# EAGLE design Actor_8_Channel (EAGLE 6.1)
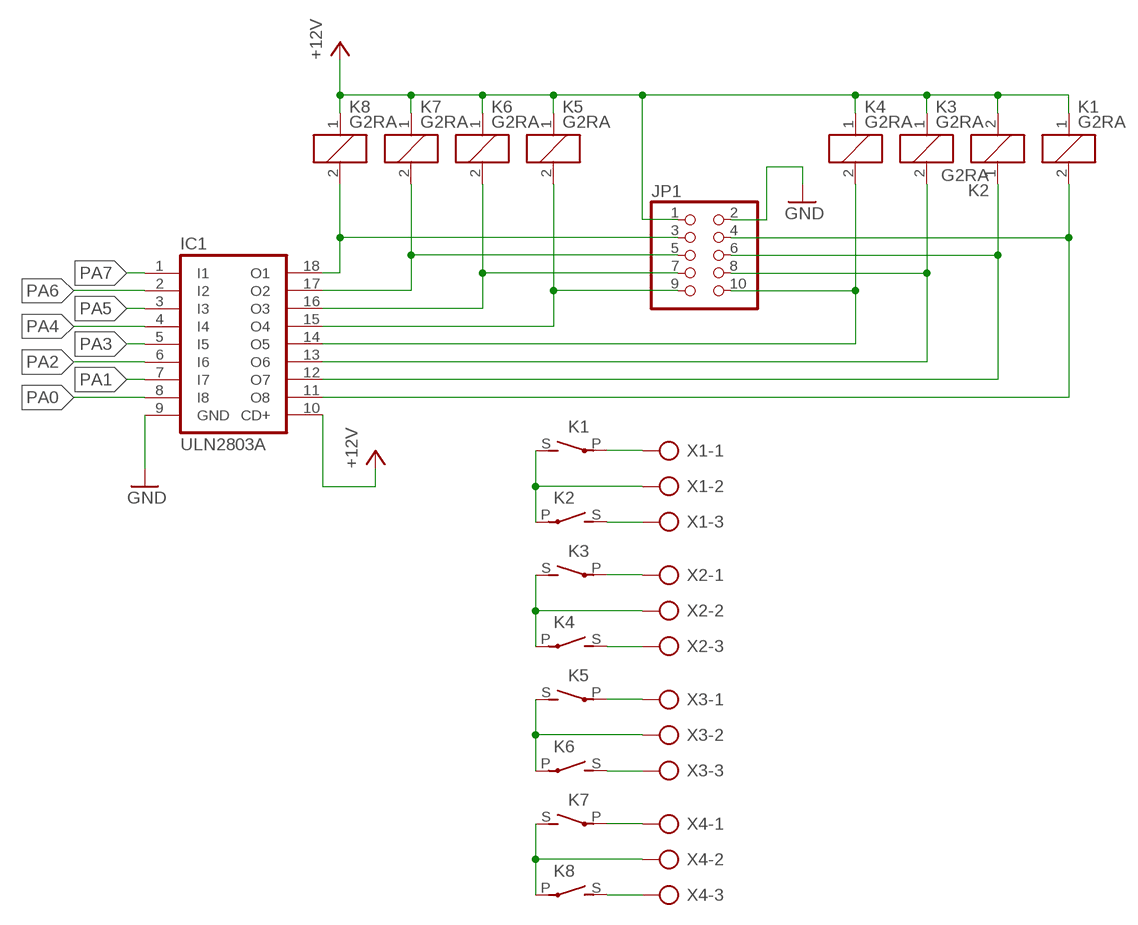
[diagram p0: schematic, sheet 1, part 1 of 2]
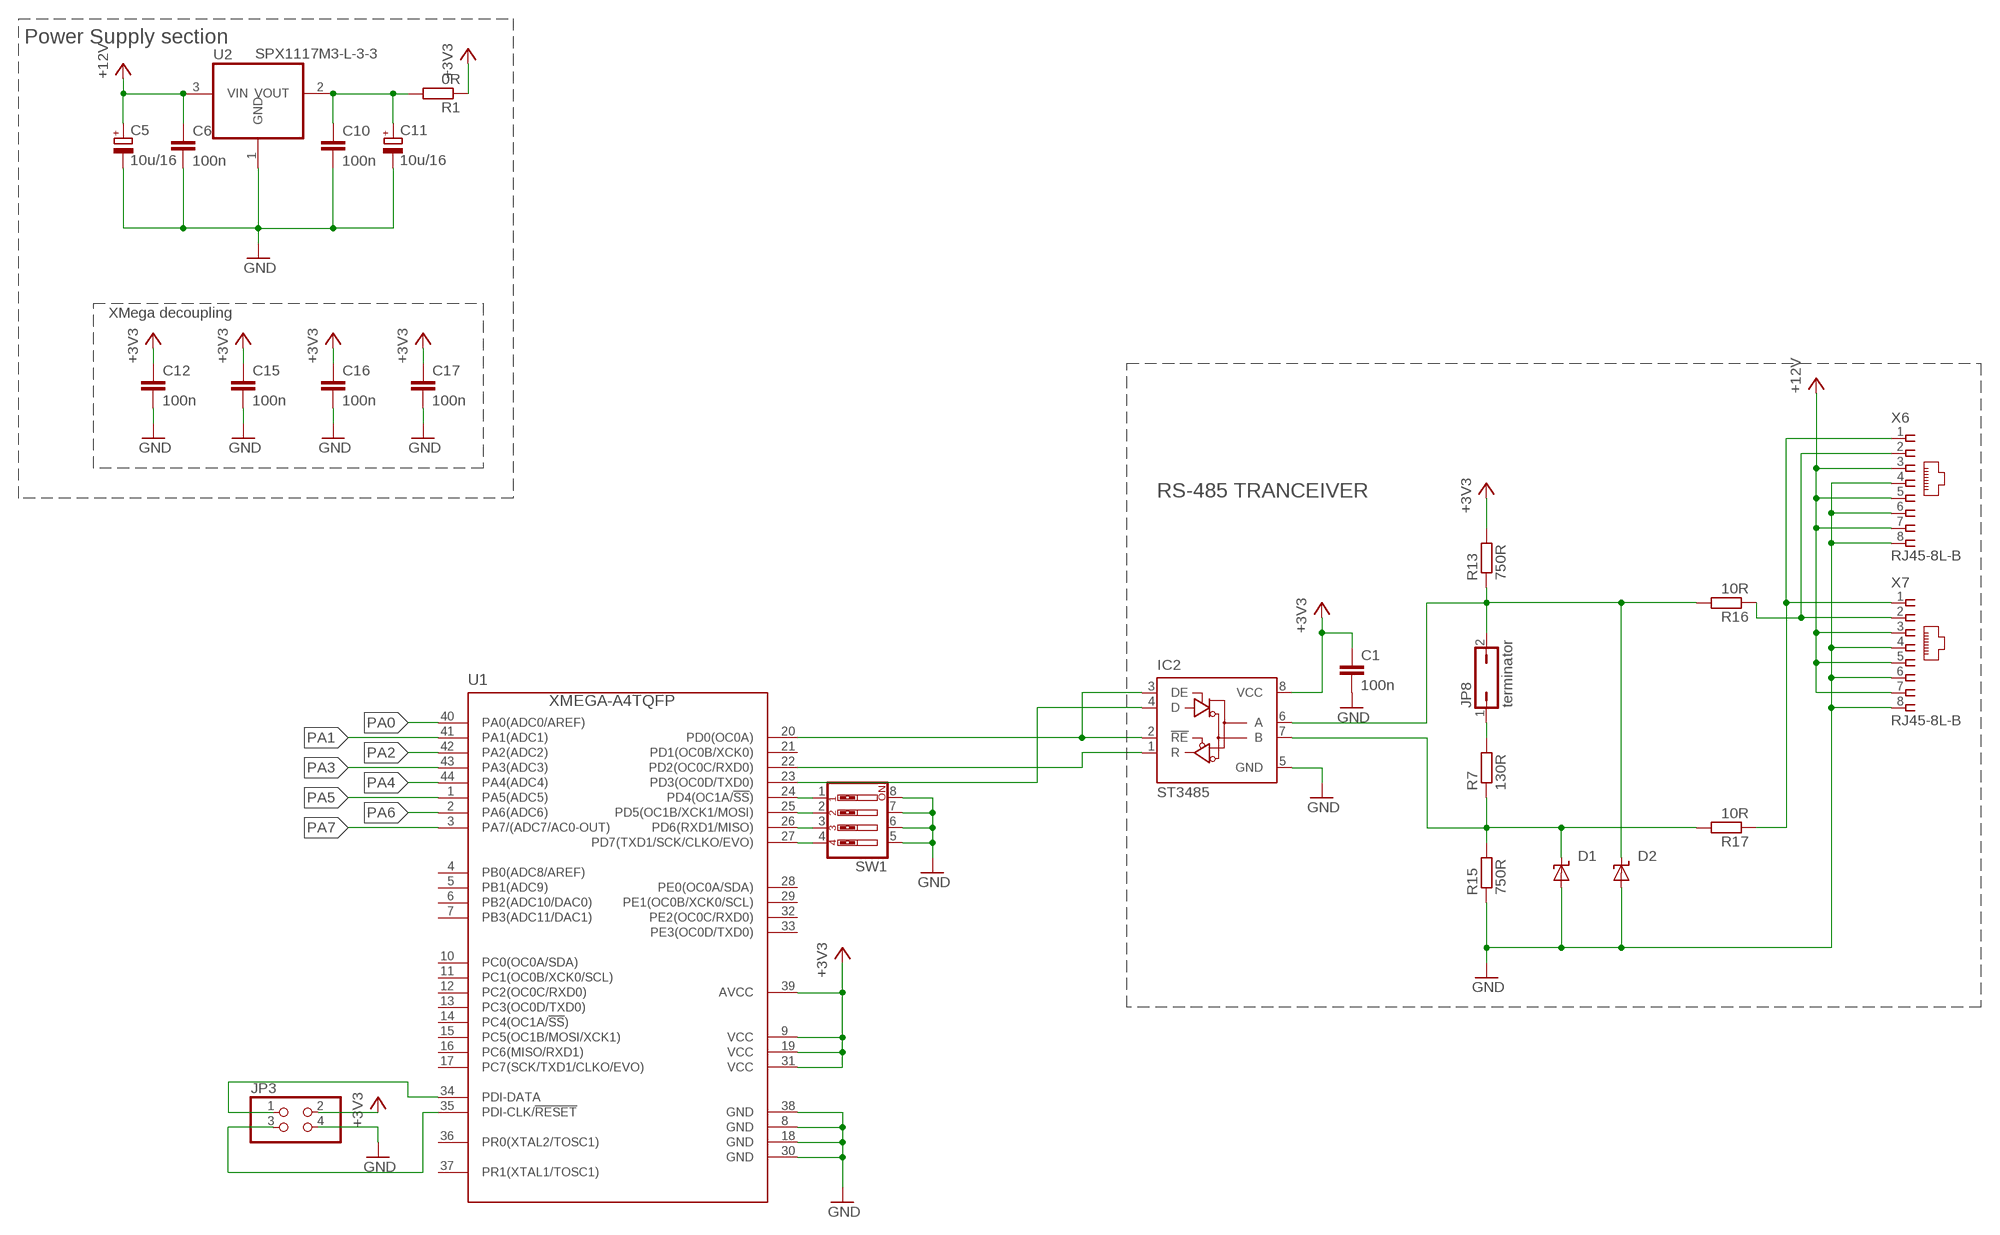
[diagram p1: schematic, sheet 1, part 2 of 2]

## Parts
C1  100n  C-EUC1206  [C1206]
C5  10u/16  CPOL-EUSMCC  [SMC_C]
C6  100n  C-EUC1206  [C1206]
C10  100n  C-EUC1206  [C1206]
C11  10u/16  CPOL-EUSMCC  [SMC_C]
C12  100n  C-EUC1206  [C1206]
C15  100n  C-EUC1206  [C1206]
C16  100n  C-EUC1206  [C1206]
C17  100n  C-EUC1206  [C1206]
D1  SUPPRESSOR-SMBJ  [SMBJ]
D2  SUPPRESSOR-SMBJ  [SMBJ]
IC1  ULN2803A  ULN2803ASMD_SO18  [SO18W]
IC2  ST3485  75176AD  [D_R-PDSO-G8]
JP1  PINHD-2X5  [2X05]
JP3  PINHD-2X2  [2X02]
JP8  terminator  JP1Q  [JP1]
K1  G2RA  [G2RA]
K2  G2RA  [G2RA]
K3  G2RA  [G2RA]
K4  G2RA  [G2RA]
K5  G2RA  [G2RA]
K6  G2RA  [G2RA]
K7  G2RA  [G2RA]
K8  G2RA  [G2RA]
R1  0R  R-EU_M1206  [M1206]
R7  130R  R-EU_M1206  [M1206]
R13  750R  R-EU_M1206  [M1206]
R15  750R  R-EU_M1206  [M1206]
R16  10R  R-EU_M1206  [M1206]
R17  10R  R-EU_M1206  [M1206]
SW1  SW_DIP-4  [EDG-04]
U1  XMEGA-A4TQFP  [TQFP44]
U2  SPX1117M3-L-3-3  REG1117  [SOT223]
X1  MKDS_5/3-7,5  [MKDS_5/-750]
X2  MKDS_5/3-7,5  [MKDS_5/-750]
X3  MKDS_5/3-7,5  [MKDS_5/-750]
X4  MKDS_5/3-7,5  [MKDS_5/-750]
X6  RJ45-8L-B  [RJ45-NO-SHIELD]
X7  RJ45-8L-B  [RJ45-NO-SHIELD]

## Nets
+3V3: C1.1 C10.1 C11.+ C12.1 C15.1 C16.1 C17.1 IC2.8(VCC) JP3.2 R1.1 R1.2 R13.2 U1.9(VCC) U1.19(VCC) U1.31(VCC) U1.39(AVCC) U2.2(VOUT)
+12V: C5.+ C6.1 IC1.10(CD+) JP1.1 K1.1 K2.2 K3.1 K4.1 K5.1 K6.1 K7.1 K8.1 U2.3(VIN) X6.3 X6.5 X6.7 X7.3 X7.5 X7.7
GND: C1.2 C5.- C6.2 C10.2 C11.- C12.2 C15.2 C16.2 C17.2 D1.A D2.A IC1.9(GND) IC2.5(GND) JP1.2 JP3.4 R15.1 SW1.5 SW1.6 SW1.7 SW1.8 U1.8(GND) U1.18(GND) U1.30(GND) U1.38(GND) U2.1(GND) X6.4 X6.6 X6.8 X7.4 X7.6 X7.8
N$1: K1.P(2:P) X1.1
N$2: K3.P(2:P) X2.1
N$3: K5.P(2:P) X3.1
N$4: K7.P(2:P) X4.1
N$5: K6.S(2:S) X3.3
N$6: IC1.18(O1) JP1.3 K8.2
N$7: IC1.17(O2) JP1.5 K7.2
N$8: IC1.16(O3) JP1.7 K6.2
N$9: IC1.15(O4) JP1.9 K5.2
N$10: IC1.14(O5) JP1.10 K4.2
N$11: IC1.13(O6) JP1.8 K3.2
N$12: IC1.12(O7) JP1.6 K2.1
N$13: IC1.11(O8) JP1.4 K1.2
N$14: R17.1 X6.1 X7.1
N$15: JP8.1 R7.2
N$16: D1.C IC2.7(B) R7.1 R15.2 R17.2
N$17: R16.1 X6.2 X7.2
N$18: SW1.1 U1.24(PD4(OC1A/!SS!))
N$19: SW1.2 U1.25(PD5(OC1B/XCK1/MOSI))
N$20: SW1.3 U1.26(PD6(RXD1/MISO))
N$21: SW1.4 U1.27(PD7(TXD1/SCK/CLKO/EVO))
N$22: K1.S(2:S) K2.P(2:P) X1.2
N$23: K2.S(2:S) X1.3
N$25: K3.S(2:S) K4.P(2:P) X2.2
N$26: K4.S(2:S) X2.3
N$29: K5.S(2:S) K6.P(2:P) X3.2
N$44: JP3.1 U1.34(PDI-DATA)
N$45: JP3.3 U1.35(PDI-CLK/!RESET)
N$50: K7.S(2:S) K8.P(2:P) X4.2
N$51: K8.S(2:S) X4.3
PA0: IC1.8(I8) U1.40(PA0(ADC0/AREF))
PA1: IC1.7(I7) U1.41(PA1(ADC1))
PA2: IC1.6(I6) U1.42(PA2(ADC2))
PA3: IC1.5(I5) U1.43(PA3(ADC3))
PA4: IC1.4(I4) U1.44(PA4(ADC4))
PA5: IC1.3(I3) U1.1(PA5(ADC5))
PA6: IC1.2(I2) U1.2(PA6(ADC6))
PA7: IC1.1(I1) U1.3(PA7/(ADC7/AC0-OUT))
PD_0: IC2.2(!RE) IC2.3(DE) U1.20(PD0(OC0A))
PD_2: IC2.1(R) U1.22(PD2(OC0C/RXD0))
PD_3: IC2.4(D) U1.23(PD3(OC0D/TXD0))
RS485_A1: D2.C IC2.6(A) JP8.2 R13.1 R16.2
Unconnected: U1.4(PB0(ADC8/AREF)) U1.5(PB1(ADC9)) U1.6(PB2(ADC10/DAC0)) U1.7(PB3(ADC11/DAC1)) U1.10(PC0(OC0A/SDA)) U1.11(PC1(OC0B/XCK0/SCL)) U1.12(PC2(OC0C/RXD0)) U1.13(PC3(OC0D/TXD0)) U1.14(PC4(OC1A/!SS!)) U1.15(PC5(OC1B/MOSI/XCK1)) U1.16(PC6(MISO/RXD1)) U1.17(PC7(SCK/TXD1/CLKO/EVO)) U1.21(PD1(OC0B/XCK0)) U1.28(PE0(OC0A/SDA)) U1.29(PE1(OC0B/XCK0/SCL)) U1.32(PE2(OC0C/RXD0)) U1.33(PE3(OC0D/TXD0)) U1.36(PR0(XTAL2/TOSC1)) U1.37(PR1(XTAL1/TOSC1))

## Notes on the sheet
- Power Supply section
- XMega decoupling
- RS-485 TRANCEIVER

## Library data of the parts
C1 C6 C10 C12 C15-C17 = rcl:C-EU: CAPACITOR, European symbol
C5 C11 = rcl:CPOL-EU: POLARIZED CAPACITOR, European symbol
D1 D2 = diode:SUPPRESSOR-: Suppressor diode
IC1 = uln-udn:ULN2803A: DRIVER ARRAY
IC2 = 751xx:75176A: DIFFERENTIAL BUS TRANSCEIVER Source: http://focus.ti.com/lit/ds/symlink/sn75176a.pdf
JP1 = pinhead:PINHD-2X5: PIN HEADER
JP3 = pinhead:PINHD-2X2: PIN HEADER
JP8 = jumper:JP1Q: JUMPER
K1-K8 = relay:G2RA: RELAY 1 x norm. open, Omron; OC_FARNELL: unknown; OC_NEWARK: unknown
R1 R7 R13 R15-R17 = rcl:R-EU_: RESISTOR, European symbol
SW1 = special:SW_DIP-4: DIP SWITCH
U1 = avr-7:XMEGA-A4: Atmel XMega A4 series processor
U2 = burr-brown:REG1117: 800mA and 1A Low Dropout (LDO) Positive Regulator 1.8V, 2.5V, 2.85V, 3.3V, 5V, and Adj; MPN: REG1117; OC_FARNELL: 1097566; OC_NEWARK: 14P6981
X1-X4 = con-phoenix-mkds_5:MKDS_5/3-: MKDS 5/3-6,35 Source: PHOENIX CONTACT
X6 X7 = con-tycoelectronics:RJ45: CORCOM Modular RJ Jacks No Shield Source: www.tycoelectronics.com .. ENG_DS_1654001_1099_RJ_L_0507.pdf; MF: TYCO ELECTRONICS; MPN: RJ45-8L-B; OC_FARNELL: 1279843; OC_NEWARK: 52K4445

## Board
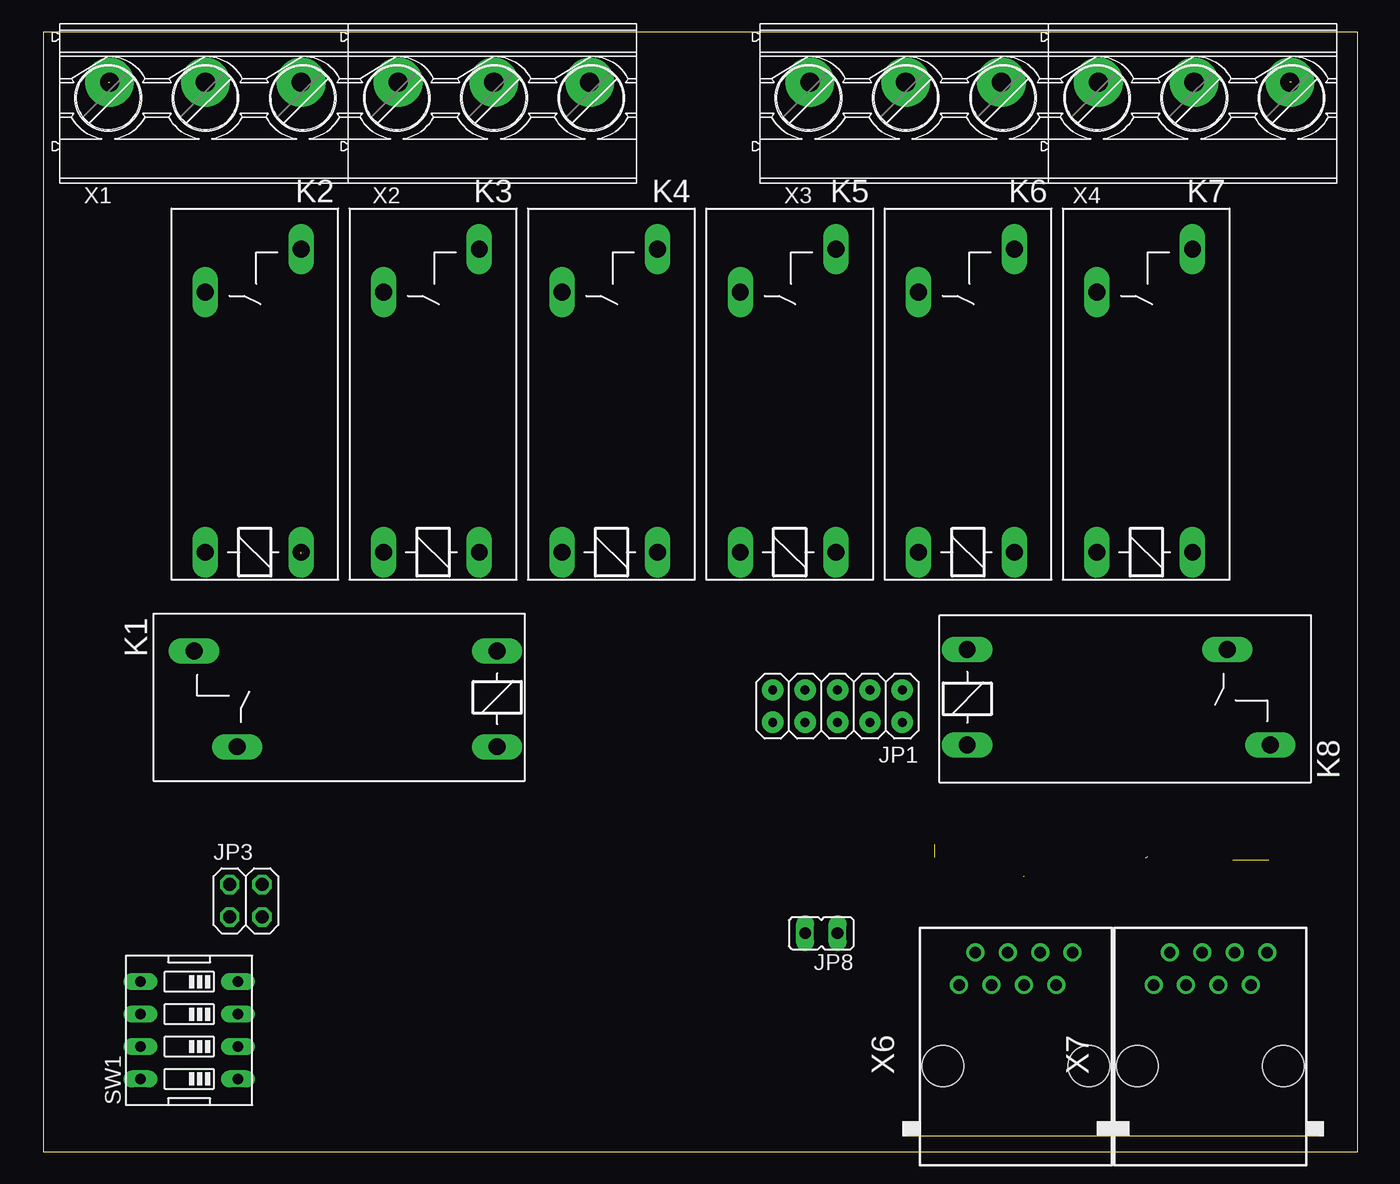
[diagram p2: board, top side]
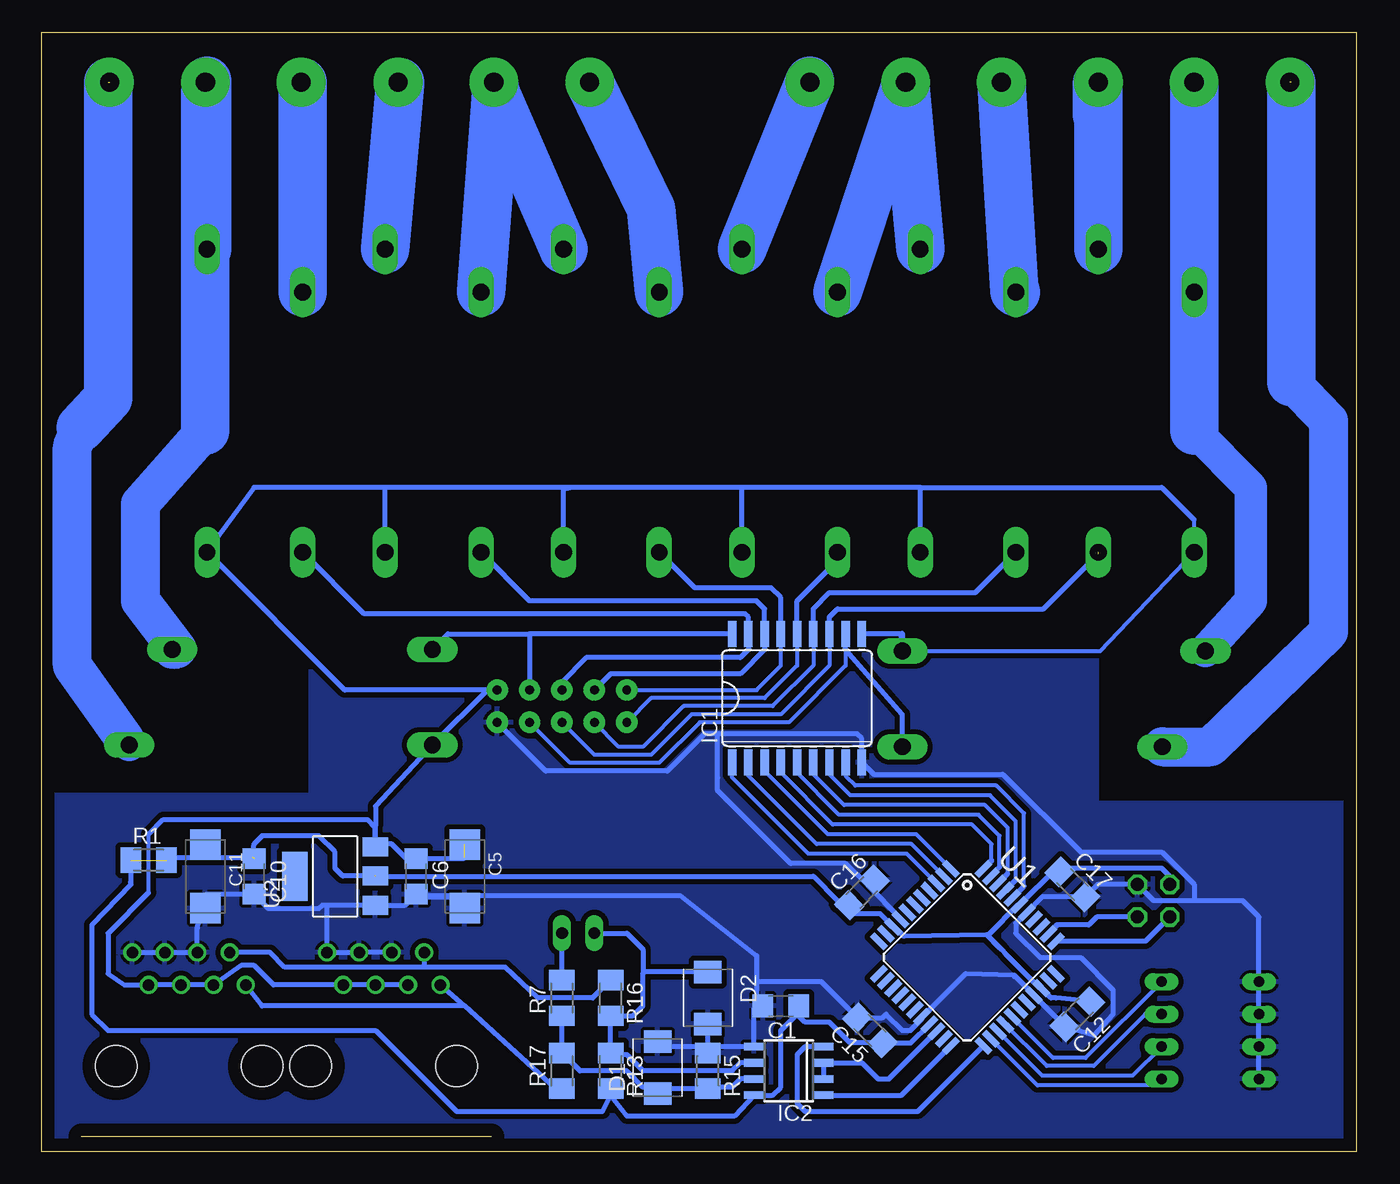
[diagram p3: board, bottom side, seen from below]

Size 103 x 87.73 mm. Coordinates in mm from the lower left corner, seen from the top.
Outline: 0,0 103,0 103,87.73 0,87.73 0,0
Copper layers (1*16): Top 0.035mm / dielectric 1.5mm / Bottom 0.035mm
Design rules: minimum track width 10mil, minimum drill 24mil, track to track 8mil, track to pad 8mil, pad to pad 8mil, via to via 8mil, smd to smd 8mil, copper to edge 40mil, drill to drill 8mil, minimum pad ring 10mil, minimum via ring 8mil, stop-mask expansion 4mil, vias tented up to drill 0mil, thermal gap 10mil

### Footprints (pad centres in the part's own frame; a part is rotated, then mirrored left to right if it is on the bottom)
C1206 = smd 1.6 x 1.8: 1 -1.4,0; 2 1.4,0
SMC_C = smd 2.4 x 2.4: + -2.5,0; - 2.5,0
SMBJ = smd 1.78 x 2.16: A 2.04,0; C -2.03,0
SO18W = smd 0.66 x 2.032: 1 -5.08,-5.029; 2 -3.81,-5.029; 3 -2.54,-5.029; 4 -1.27,-5.029; 5 0,-5.029; 6 1.27,-5.029; 7 2.54,-5.029; 8 3.81,-5.029; 9 5.08,-5.029; 10 5.08,5.029; 11 3.81,5.029; 12 2.54,5.029; 13 1.27,5.029; 14 0,5.029; 15 -1.27,5.029; 16 -2.54,5.029; 17 -3.81,5.029; 18 -5.08,5.029
D_R-PDSO-G8 = smd 0.6 x 1.5: 1 -1.905,-2.75; 2 -0.635,-2.75; 3 0.635,-2.75; 4 1.905,-2.75; 5 1.905,2.75; 6 0.635,2.75; 7 -0.635,2.75; 8 -1.905,2.75
2X05 = drill 0.7 pad 1.676: 1 -5.08,-1.27; 2 -5.08,1.27; 3 -2.54,-1.27; 4 -2.54,1.27; 5 0,-1.27; 6 0,1.27; 7 2.54,-1.27; 8 2.54,1.27; 9 5.08,-1.27; 10 5.08,1.27
2X02 = drill 1.016 octagon: 1 -1.27,-1.27; 2 -1.27,1.27; 3 1.27,-1.27; 4 1.27,1.27
JP1 = drill 0.914 long: 1 0,-1.27; 2 0,1.27
G2RA = drill 1.321 long: 1 -3.81,-3.683; 2 -3.81,3.81; P 16.561,3.81; S 19.939,-3.683
M1206 = smd 1.6 x 2: 1 -1.4,0; 2 1.4,0
EDG-04 = drill 0.813 long: 1 -3.81,-3.81; 2 -1.27,-3.81; 3 1.27,-3.81; 4 3.81,-3.81; 5 3.81,3.81; 6 1.27,3.81; 7 -1.27,3.81; 8 -3.81,3.81
TQFP44 = smd 1.5 x 0.5: 1 -5.8,4; 2 -5.8,3.2; 3 -5.8,2.4; 4 -5.8,1.6; 5 -5.8,0.8; 6 -5.8,0; 7 -5.8,-0.8; 8 -5.8,-1.6; 9 -5.8,-2.4; 10 -5.8,-3.2; 11 -5.8,-4; 23 5.8,-4; 24 5.8,-3.2; 25 5.8,-2.4; 26 5.8,-1.6; 27 5.8,-0.8; 28 5.8,0; 29 5.8,0.8; 30 5.8,1.6; 31 5.8,2.4; 32 5.8,3.2; 33 5.8,4 | smd 0.5 x 1.5: 12 -4,-5.8; 13 -3.2,-5.8; 14 -2.4,-5.8; 15 -1.6,-5.8; 16 -0.8,-5.8; 17 0,-5.8; 18 0.8,-5.8; 19 1.6,-5.8; 20 2.4,-5.8; 21 3.2,-5.8; 22 4,-5.8; 34 4,5.8; 35 3.2,5.8; 36 2.4,5.8; 37 1.6,5.8; 38 0.8,5.8; 39 0,5.8; 40 -0.8,5.8; 41 -1.6,5.8; 42 -2.4,5.8; 43 -3.2,5.8; 44 -4,5.8
SOT223 = smd 1.499 x 2.007: 1 -2.261,-3.15; 2 0.025,-3.15; 3 2.311,-3.15 | smd 3.81 x 2.007: 4 0,3.15
MKDS_5/-750 = drill 1.5 pad 3.81: 1 -7.5,0; 2 0,0; 3 7.5,0
RJ45-NO-SHIELD = drill 0.9 pad 1.4: 1 -4.445,6.35; 2 -3.175,8.89; 3 -1.905,6.35; 4 -0.635,8.89; 5 0.635,6.35; 6 1.905,8.89; 7 3.175,6.35; 8 4.445,8.89 | hole 3.251: -5.715,0; 5.715,0

### Placement (x,y rotation side)
C1  45.09,11.43 180 bottom
C5  69.85,21.59 270 bottom
C6  73.66,21.59 270 bottom
C10  86.36,21.59 270 bottom
C11  90.17,21.59 270 bottom
C12  21.84,10.79 225 bottom
C15  38.1,9.53 135 bottom
C16  38.73,20.32 45 bottom
C17  22.23,20.95 315 bottom
D1  54.74,6.6 90 bottom
D2  50.8,12.06 270 bottom
IC1  43.81,35.56 0 bottom
IC2  44.45,6.35 90 bottom
JP1  62.23,34.92 180 top
JP3  15.88,19.68 0 top
JP8  60.96,17.14 90 top
K1  31.75,35.56 180 top
K2  16.51,50.8 90 top
K3  30.48,50.8 90 top
K4  44.45,50.8 90 top
K5  58.42,50.8 90 top
K6  72.39,50.8 90 top
K7  86.36,50.8 90 top
K8  76.2,35.56 0 top
R1  94.61,22.86 0 bottom
R7  62.23,12.06 90 bottom
R13  58.42,6.35 270 bottom
R15  50.8,6.35 270 bottom
R16  58.42,12.06 270 bottom
R17  62.23,6.35 90 bottom
SW1  11.43,9.53 90 top
U1  30.48,15.24 315 bottom
U2  80.01,21.59 90 bottom
X1  12.7,83.82 0 top
X2  35.31,83.82 0 top
X3  67.56,83.82 0 top
X4  90.17,83.82 0 top
X6  76.2,6.73 0 top
X7  91.44,6.73 0 top

### Tracks (layer width: path | path; a pad name or v marks a point on that pad's centre or on a via)
+3V3  (3 unrouted)
  Bottom 0.305: 40.64,19.3 40.51,19.3 40.49,19.33 C16.1 | 28.96,17.02 27.81,15.88
  Bottom 0.406: 43.81,10.79 45.09,9.53 45.09,5.08 45.72,4.45 IC2.8 48.72,2.79 57.15,2.79 58.42,4.45 | 43.81,10.79 43.81,11.3 C1.1 | C16.1 39.73,18.9 39.5,18.67 37.3,18.67 U1.9 36.19,17.64 35.43,16.89 28.96,17.02 27.94,16 | 58.42,4.45 R13.2 | 43.81,10.79 43.18,10.16 41.27,10.16 39.65,8.54 C15.1 34.92,8.54 U1.19 | 23.5,22.23 U1.39 26.51,19.34 28.83,17.02 28.83,16.89 27.81,15.88 27.43,15.49 24.77,12.84 U1.31 23.91,12.06 23.5,12.06 C12.1 | 23.5,22.23 | 23.5,22.23 C17.1 22.93,22.23 15.24,22.23 14.61,21.59 JP3.2 | R1.1 96.02,21.08 96.01,21.21 96.01,20.95 99.06,17.78 99.06,10.79 97.79,9.53 76.83,9.53 70.48,3.17 59.05,3.17 58.42,4.45 | 76.83,21.59 42.55,21.59 40.64,19.68 40.64,19.3 | U2.2 79.4,21.61 80.01,22.23 80.01,23.5 81.28,24.77 85.72,24.77 86.36,24.13 86.49,23.11 86.59,23.09 90.32,23.09 | R1.2 92.98,23.09 90.32,23.09 | 90.32,23.09 90.17,23.24 C11.+
+12V  (1 unrouted)
  Bottom 0.305: 12.7,49.53 K2.2 20.07,39.24 K1.1 | 94.61,20.32 94.61,24.89
  Bottom 0.406: 69.85,23.09 69.95,22.99 C6.1 74.42,22.99 75.56,24.13 76.63,24.13 U2.3 | 34.16,52.07 15.24,52.07 12.7,49.53 | K3.1 34.16,52.07 | 34.16,52.07 48.26,52.07 | 48.26,52.07 61.59,52.07 | 61.59,52.07 76.2,52.07 | 76.2,52.07 86.36,52.07 90.17,46.86 K7.1 79.25,36.2 JP1.1 68.07,36.2 K8.1 76.83,27.1 U2.3 | K6.1 76.07,51.94 76.2,52.07 | K5.1 62.1,51.94 61.59,52.07 | K4.1 48.13,51.94 48.26,52.07 | IC1.10 35.64,40.59 K1.1 35.56,40.64 | X6.3 X6.5 X6.7 84.84,13.08 86.36,14.61 87.38,14.61 X7.3 X7.5 X7.7 96.52,13.08 97.79,13.97 97.79,17.14 94.61,20.32 | U2.3 76.86,25.43 77.47,26.04 93.47,26.04 94.61,24.89
GND
  Bottom 0.305: 50.04,28.96 50.04,29.34 | U1.18 33.88,10.7 | 26.8,13.84 26.8,13.72
  Bottom 0.406: 50.8,8.26 D2.A | 50.8,8.26 R15.1 50.3,8.26 IC2.5 47.2,11.22 46.99,11.43 C1.2 46.99,11.94 46.99,13.34 | 50.8,8.26 54.48,8.26 D1.A | 80.64,19.33 U2.1 74.52,19.33 C6.2 73.56,20.09 52.98,20.09 46.99,15.37 46.99,13.34 | 80.64,19.33 81,19.33 81.28,19.05 85.22,19.05 C10.2 90.07,20.19 | X7.8 X7.6 X7.4 90.81,17.55 90.07,20.19 | 80.64,19.33 X6.8 X6.6 X6.4 | C15.2 37.11,10.52 36.83,10.79 35.56,9.53 34.92,9.53 34.02,10.43 U1.18 | 12.7,19.68 15.88,19.68 JP3.4 20.25,20.95 C17.2 24.62,19.96 U1.38 26.67,17.92 26.67,17.14 24.77,15.24 21.59,15.24 19.05,12.7 19.05,10.79 20.57,9.14 C12.2 22.83,9.86 U1.30 25.25,12.29 26.8,13.84 30.61,13.97 33.88,10.7 | U1.8 35.71,18.31 38.23,20.83 | 12.7,19.68 12.7,20.95 15.24,23.5 21.59,23.5 27.69,29.59 37.8,29.59 IC1.9 38.73,32.38 39.12,32.77 50.04,32.77 | JP1.2 63.5,29.84 53.98,29.84 51.05,32.77 50.04,32.77 | 50.04,32.77 50.04,29.34 50.04,28.32 44.32,22.61 40.01,22.61 38.23,20.83 | SW1.8 SW1.7 SW1.6 SW1.5 7.62,18.41 8.89,19.68 12.7,19.68 | C16.2 38.23,20.83 | C15.2 | C15.2 41.91,13.34 46.99,13.34 | C5.- 69.85,19.81 69.98,19.94 73.53,19.94 73.66,20.07 | 90.07,20.19 90.07,19.19 C11.-
  pour Bottom (isolate 0.406): 0,0 0,27.3 20.32,27.3 20.32,62.23 81.92,62.23 81.92,27.94 102.87,27.94 102.87,0
N$1  (1 unrouted)
  Bottom 3.048: K1.P 11.43,31.75 2.16,40.77 2.16,57.28 5.08,60.33
  Bottom 3.81: 5.08,60.33 5.08,83.82
N$2
  Bottom 3.81: K3.P 26.8,67.69 26.79,67.43 X2.1
N$3
  Bottom 3.81: K5.P 55.24,73.92 X3.1
N$4
  Bottom 3.81: K7.P 82.55,83.7 | 82.55,83.82 82.55,83.7 | 82.55,83.7 X4.1
N$5
  Bottom 3.81: K6.S 74.93,83.69 74.93,83.82 X3.3
N$6
  Bottom 0.406: IC1.18 64.77,40.59 | K8.2 71.17,40.59 64.77,40.59 | 64.77,40.59 JP1.3
N$7
  Bottom 0.406: JP1.5 62.23,36.83 60.33,38.73 48.26,38.73 47.62,39.37 IC1.17 47.62,41.91 47.88,42.16 77.72,42.16 K7.2
N$8
  Bottom 0.406: JP1.7 58.42,37.47 48.26,37.47 46.35,39.37 IC1.16 46.35,42.55 46.99,43.18 64.77,43.18 K6.2
N$9
  Bottom 0.305: JP1.9 46.99,36.2 45.09,38.1 IC1.15
  Bottom 0.406: IC1.15 45.09,43.43 45.85,44.2 51.82,44.2 K5.2
N$10
  Bottom 0.305: IC1.14 43.81,38.1 46.35,35.56 55.24,35.56 JP1.10
  Bottom 0.406: IC1.14 43.81,43.18 40.64,46.35 K4.2
N$11
  Bottom 0.305: IC1.13 42.55,38.1 45.72,34.92 52.7,34.92 55.88,31.75 57.78,31.75 JP1.8
  Bottom 0.406: IC1.13 42.55,42.55 41.27,43.81 29.84,43.81 K3.2
N$12  (1 unrouted)
  Bottom 0.305: IC1.12 41.27,38.1 45.09,34.29 52.07,34.29 55.24,31.11 59.69,31.11 JP1.6
  Bottom 0.406: IC1.12 41.27,41.91 40.64,42.55 24.51,42.55 20.19,46.86
N$13
  Bottom 0.305: 40.01,39.37 40.01,38.1 44.45,33.66 51.44,33.66 54.61,30.48 61.59,30.48 JP1.4
  Bottom 0.406: K1.2 35.56,34.29 40.01,39.37 IC1.11
N$14
  Bottom 0.406: R17.1 62.73,4.95 69.85,11.43 | 69.85,11.43 85.72,11.43 X7.1 | X6.1 69.85,11.43
N$15
  Bottom 0.406: R7.2 JP8.1
N$16
  Bottom 0.406: IC2.7 48.26,5.71 48.9,5.08 50.8,5.08 R15.2 54.48,4.95 54.61,5.08 | 54.61,5.08 D1.C | 54.61,5.08 55.88,5.08 57.15,6.35 60.83,6.35 R17.2 R7.1
N$17
  Bottom 0.406: R16.1 59.82,12.06 64.14,12.06 66.67,14.48 73.03,14.48 | X6.2 73.03,14.48 | 73.03,14.48 83.95,14.48 85.09,15.62 X7.2
N$18
  Bottom 0.305: SW1.1 15.37,5.71 15.88,5.21 24.97,5.21 U1.24
N$19
  Bottom 0.305: SW1.2 17.53,5.97 24.6,5.97 U1.25
N$20
  Bottom 0.305: 16.51,10.79 20.57,6.73 24.26,6.73 27.69,10.16
  Bottom 0.406: SW1.3 16.51,10.79 | 27.81,10.29 27.81,10.41 27.51,10.11 U1.26 27.66,10.16 27.69,10.16
N$21
  Bottom 0.305: SW1.4 21.21,7.37 23.75,7.37 26.92,10.54
  Bottom 0.406: U1.27 27.3,10.92 | U1.27 | U1.27 26.92,10.54
N$22
  Bottom 2.54: K1.S 8.26,43.18 8.26,52.07 12.7,56.52
  Bottom 3.81: X1.2 K2.P 12.7,56.52
N$23
  Bottom 3.81: K2.S 20.19,83.69 20.32,81.28 20.32,83.7 X1.3
N$25
  Bottom 3.81: K4.P 35.34,83.52 | 35.34,83.52 K3.S | X2.2 35.34,83.52
N$26
  Bottom 3.81: K4.S 42.81,83.94 X2.3
N$29
  Bottom 3.81: K5.S 67.38,82.91 | 67.38,82.91 K6.P | X3.2 67.38,82.91
N$44
  Bottom 0.406: JP3.1 16.51,16.51 U1.34
N$45
  Bottom 0.406: JP3.3 20.32,18.41 20.95,17.78 23.5,17.78 23.5,17.7 U1.35
N$50
  Bottom 3.048: K8.P 92.38,39.42 95.25,43.18 95.25,50.8 90.17,56.52
  Bottom 3.81: K7.S 90.04,72.39 | 90.04,72.39 90.04,83.95 X4.2 | 90.17,56.52 90.17,83.06 90.04,72.39
N$51  (1 unrouted)
  Bottom 2.54: K8.S 96.52,32.38
  Bottom 3.048: 96.52,32.38 100.58,38.1 100.58,55.24 99.95,56.77
  Bottom 3.81: 97.79,83.82 97.79,59.05 99.95,56.77
PA0
  Bottom 0.305: 26.04,20.82 26.04,26.54 28.19,28.7 39.24,28.7 40.01,29.46 IC1.8
  Bottom 0.406: U1.40 26.04,20.82
PA1
  Bottom 0.305: 26.67,21.31 26.67,25.91 28.7,27.94 39.62,27.94 41.27,29.59 IC1.7
  Bottom 0.406: U1.41 26.67,21.31
PA2
  Bottom 0.305: 27.3,21.81 27.3,25.4 29.08,27.18 40.13,27.18 42.55,29.59 IC1.6
  Bottom 0.406: U1.42 27.3,21.81
PA3
  Bottom 0.305: 27.94,22.3 27.94,24.77 29.59,26.42 40.51,26.42 43.94,29.84
  Bottom 0.406: U1.43 27.94,22.3 | 43.94,29.84 43.94,30.4 IC1.5
PA4
  Bottom 0.305: 28.57,22.86 28.57,24.13 30.1,25.65 41.02,25.65 45.09,29.72
  Bottom 0.406: 45.09,29.72 IC1.4 | U1.44 28.57,22.8 28.57,22.86 29.21,22.23 U1.44
PA5
  Bottom 0.305: U1.1 34.48,24.89 41.4,24.89 46.48,29.97
  Bottom 0.406: 46.48,29.97 46.48,30.1 46.35,30.23 IC1.3
PA6
  Bottom 0.305: U1.2 34.84,24.13 42.29,24.13 47.62,29.46 IC1.2
PA7
  Bottom 0.305: U1.3 35.21,23.37 42.93,23.37 48.9,29.34 IC1.1
PD_0
  Bottom 0.406: IC2.2 IC2.3 38.73,6.99 37.47,5.71 36.61,5.71 U1.20
PD_2
  Bottom 0.406: IC2.1 35.62,4.45 U1.22
PD_3
  Bottom 0.406: IC2.4 43.18,8.26 43.81,7.62 43.81,3.81 43.18,3.17 34.34,3.17 U1.23
RS485_A1
  Bottom 0.406: IC2.6 48.26,6.99 48.9,6.35 55.88,6.35 57.15,7.62 58.29,7.62 R13.1 R16.2 56.65,10.66 55.88,11.43 55.88,13.34 55.88,13.97 | D2.C 55.76,14.1 55.88,13.97 | JP8.2 57.15,17.14 55.88,15.88 55.88,13.97